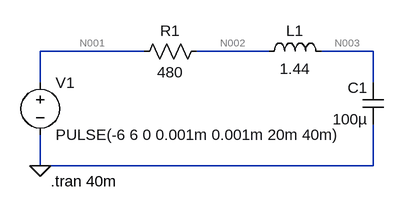
[diagram p0: schematic Draft3.asc]
Draft3.asc, the LTspice schematic file:
Version 4.1
SHEET 1 880 680
WIRE 112 96 -48 96
WIRE 304 96 192 96
WIRE 464 96 384 96
WIRE -48 144 -48 96
WIRE 464 144 464 96
WIRE -48 272 -48 224
WIRE 464 272 464 208
WIRE 464 272 -48 272
FLAG -48 272 0
SYMBOL voltage -48 128 R0
WINDOW 123 0 0 Left 0
WINDOW 39 0 0 Left 0
SYMATTR InstName V1
SYMATTR Value PULSE(-6 6 0 0.001m 0.001m 20m 40m)
SYMBOL res 208 80 R90
WINDOW 0 0 56 VBottom 2
WINDOW 3 32 56 VTop 2
SYMATTR InstName R1
SYMATTR Value 480
SYMBOL cap 480 208 R180
WINDOW 0 24 56 Left 2
WINDOW 3 24 8 Left 2
SYMATTR InstName C1
SYMATTR Value 100µ
SYMBOL ind 288 112 R270
WINDOW 0 32 56 VTop 2
WINDOW 3 5 56 VBottom 2
SYMATTR InstName L1
SYMATTR Value 1.44
SYMATTR SpiceLine Rser=0
TEXT -32 296 Left 2 !.tran 40m

The netlist it stands for:
* Draft3.asc
V1 N001 0 PULSE(-6 6 0 0.001m 0.001m 20m 40m)
R1 N002 N001 480
C1 0 N003 100µ
L1 N002 N003 1.44 Rser=0
.tran 40m
.backanno
.end

* Results of the author's LTspice run, read from the files saved beside the schematic
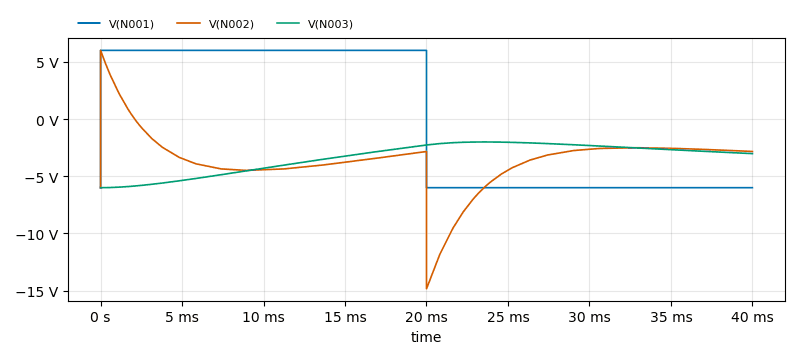
[diagram p1: Transient Analysis of Draft3.asc, plotted from the saved traces]
* Transient Analysis, 1 run:
*   V(N001): min -6 V, max 6 V, average 300 µV, rms 6 V, last -6 V
*   V(N002): min -14.84 V, max 5.998 V, average -3.573 V, rms 4.429 V, last -2.834 V
*   V(N003): min -6 V, max -2.005 V, average -3.336 V, rms 3.573 V, last -3.022 V